# EAGLE design F7 (EAGLE 9.4.0)
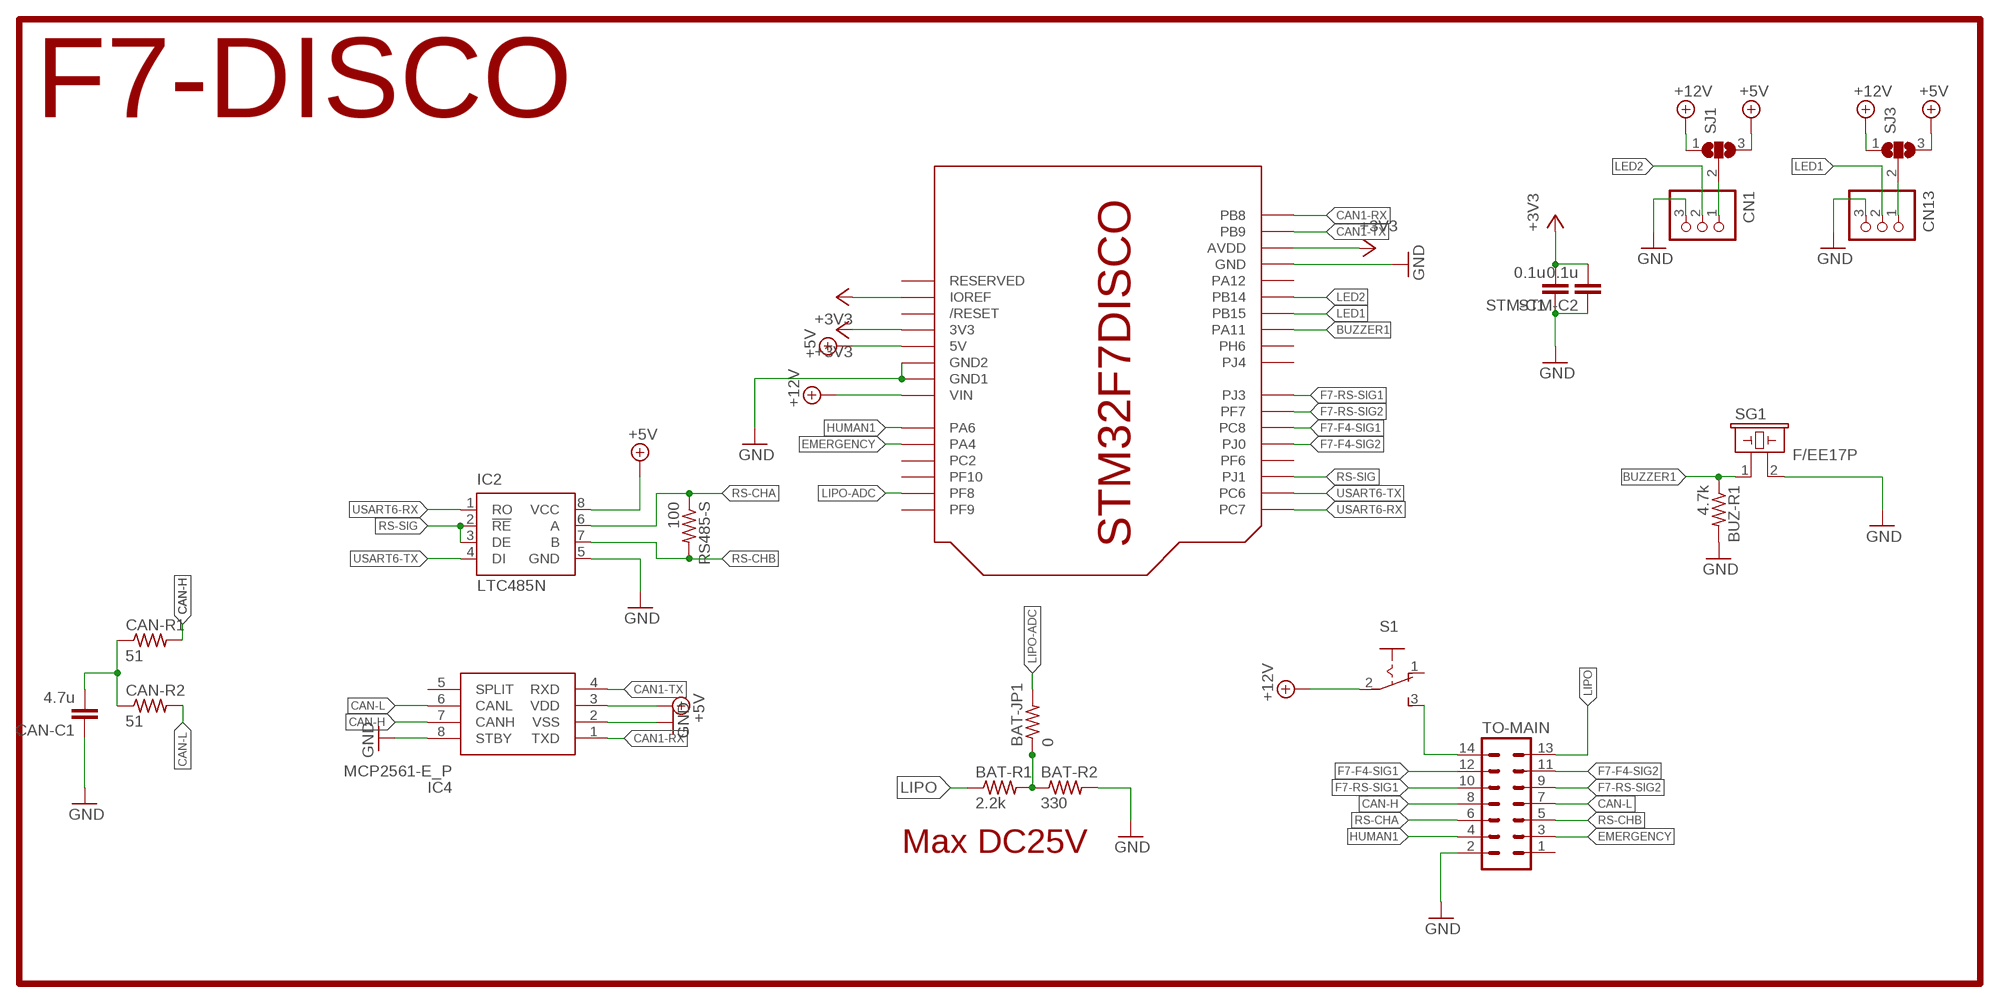
[diagram p0: schematic, sheet 1]

## Parts
BAT-JP1  0  R-US_R0805  [R0805]
BAT-R1  2.2k  R-US_R0805  [R0805]
BAT-R2  330  R-US_R0805  [R0805]
BUZ-R1  4.7k  R-US_R0805  [R0805]
CAN-C1  4.7u  C-EUC0805  [C0805]
CAN-R1  51  R-US_R0805  [R0805]
CAN-R2  51  R-US_R0805  [R0805]
CN1  B3P-VH  [B3P-VH]
CN13  B3P-VH  [B3P-VH]
IC2  LTC485N  [DIL08]
IC4  MCP2561-E_P  [DIP781W56P254L950H533Q8N]
RS485-S  100  R-US_R0805  [R0805]
S1  255SB  [255SB]
SG1  F/EE17P  [F/EE17P]
SJ1  SJ2WW  [SJ_2W]
SJ3  SJ2WW  [SJ_2W]
STM-C1  0.1u  C-EUC0805  [C0805]
STM-C2  0.1u  C-EUC0805  [C0805]
TO-MAIN  ML14  [ML14]
U$1  F7-DISCO-ARDUINO  [F7-DISCO-ARDUINO]

## Nets
+5V: IC2.8(VCC) IC4.3(VDD) SJ1.3 SJ3.3 U$1.5V
+9V: S1.2(P) SJ1.1 SJ3.1 U$1.VIN ; supply symbol labelled +12V
+12V: S1.3(S) TO-MAIN.14
BUZZER1: BUZ-R1.1 SG1.1 U$1.PA11
CAN1-RX: IC4.1(TXD) U$1.PB8
CAN1-TX: IC4.4(RXD) U$1.PB9
CAN-H: CAN-R1.2 IC4.7(CANH) TO-MAIN.8
CAN-L: CAN-R2.2 IC4.6(CANL) TO-MAIN.7
EMERGENCY: TO-MAIN.3 U$1.PA4
F7-F4-SIG1: TO-MAIN.12 U$1.PC8
F7-F4-SIG2: TO-MAIN.11 U$1.PJ0
F7-RS-SIG1: TO-MAIN.10 U$1.PJ3
F7-RS-SIG2: TO-MAIN.9 U$1.PF7
GND: BAT-R2.2 BUZ-R1.2 CAN-C1.1 CN1.3 CN13.3 IC2.5(GND) IC4.2(VSS) IC4.8(STBY) SG1.2 STM-C1.1 STM-C2.1 TO-MAIN.2 U$1.GND1(GND) U$1.GND@1(GND1) U$1.GND@2(GND2)
HUMAN1: TO-MAIN.4 U$1.PA6
LED1: CN13.2 U$1.PB15
LED2: CN1.2 U$1.PB14
LIPO: BAT-R1.1 TO-MAIN.13
LIPO-ADC: BAT-JP1.2 U$1.PF8
N$1: CN1.1 SJ1.2
N$4: CAN-C1.2 CAN-R1.1 CAN-R2.1
N$36: BAT-JP1.1 BAT-R1.2 BAT-R2.1
N$37: CN13.1 SJ3.2
RS-CHA: IC2.6(A) RS485-S.1 TO-MAIN.6
RS-CHB: IC2.7(B) RS485-S.2 TO-MAIN.5
RS-SIG: IC2.2(!RE) IC2.3(DE) U$1.PJ1
USART6-RX: IC2.1(RO) U$1.PC7
USART6-TX: IC2.4(DI) U$1.PC6
VCC: STM-C1.2 STM-C2.2 U$1.3V(3V3) U$1.AVDD U$1.IOREF ; supply symbol labelled +3V3
Unconnected: IC4.5(SPLIT) S1.1(O) TO-MAIN.1 U$1.PA12 U$1.PC2 U$1.PF6 U$1.PF9 U$1.PF10 U$1.PH6 U$1.PJ4 U$1.RESERVED U$1.RESET(/RESET)

## Notes on the sheet
- F7-DISCO
- Max DC25V

## Library data of the parts
BAT-JP1 BAT-R1 BAT-R2 BUZ-R1 CAN-R1 CAN-R2 RS485-S = 0@Mylibrary-main1:R-US_: RESISTOR, American symbol
CAN-C1 STM-C1 STM-C2 = rcl:C-EU: CAPACITOR, European symbol
CN1 CN13 = jst-vh:B3P-VH: Wire-to-Board 3.96mm pitch top mount connector Source: http://www.jst-mfg.com/product/pdf/jpn/VH.pdf http://www.jst-mfg.com/product/detail.php?series=262
IC2 = 0linear-technology:LTC485: Low Power RS485 Interface Transceiver Source: http://www.linear.com/pc/downloadDocument.do?navId=H0,C1,C1007,C1017,P2064,D1718; OC_FARNELL: unknown; OC_NEWARK: unknown
IC4 = MCP2561-E_P:MCP2561-E_P: CAN Transceiver 1Mbps 5V 125degC PDIP8 Microchip MCP2561-E/P, CAN Transceiver 1-channel IEC 61000-4-2, 8-Pin PDIP Source: Datasheet <http://uk.rs-online.com/web/p/products/7990212>; ALLIED_NUMBER: 70415102; ALLIED_PRICE-STOCK: https://www.alliedelec.com/microchip-technology-inc-mcp2561-e-p/70415102/; DESCRIPTION: CAN Transceiver 1Mbps 5V 125degC PDIP8 Microchip MCP2561-E/P, CAN Transceiver 1-channel IEC 61000-4-2, 8-Pin PDIP; HEIGHT: 5.334mm; MANUFACTURER_NAME: Microchip; MANUFACTURER_PART_NUMBER: MCP2561-E/P; MOUSER_PART_NUMBER: 579-MCP2561-E/P; MOUSER_PRICE-STOCK: https://www.mouser.com/Search/Refine.aspx?Keyword=579-MCP2561-E%2FP; RS_PART_NUMBER: 1652124; RS_PRICE-STOCK: http://uk.rs-online.com/web/p/products/1652124
S1 = 0switch:255SB: SLIDING SWITCH Distributor Buerklin, 11G810
SG1 = buzzer:F/EE17P: BUZZER Source: Buerklin; OC_FARNELL: unknown; OC_NEWARK: unknown
SJ1 SJ3 = jumper:SJ2W: SMD solder JUMPER
TO-MAIN = 0con-harting-ml:ML14: HARTING; OC_FARNELL: unknown; OC_NEWARK: unknown
U$1 = F7-DISCO:F7-DISCO-ARDUINO

## Board
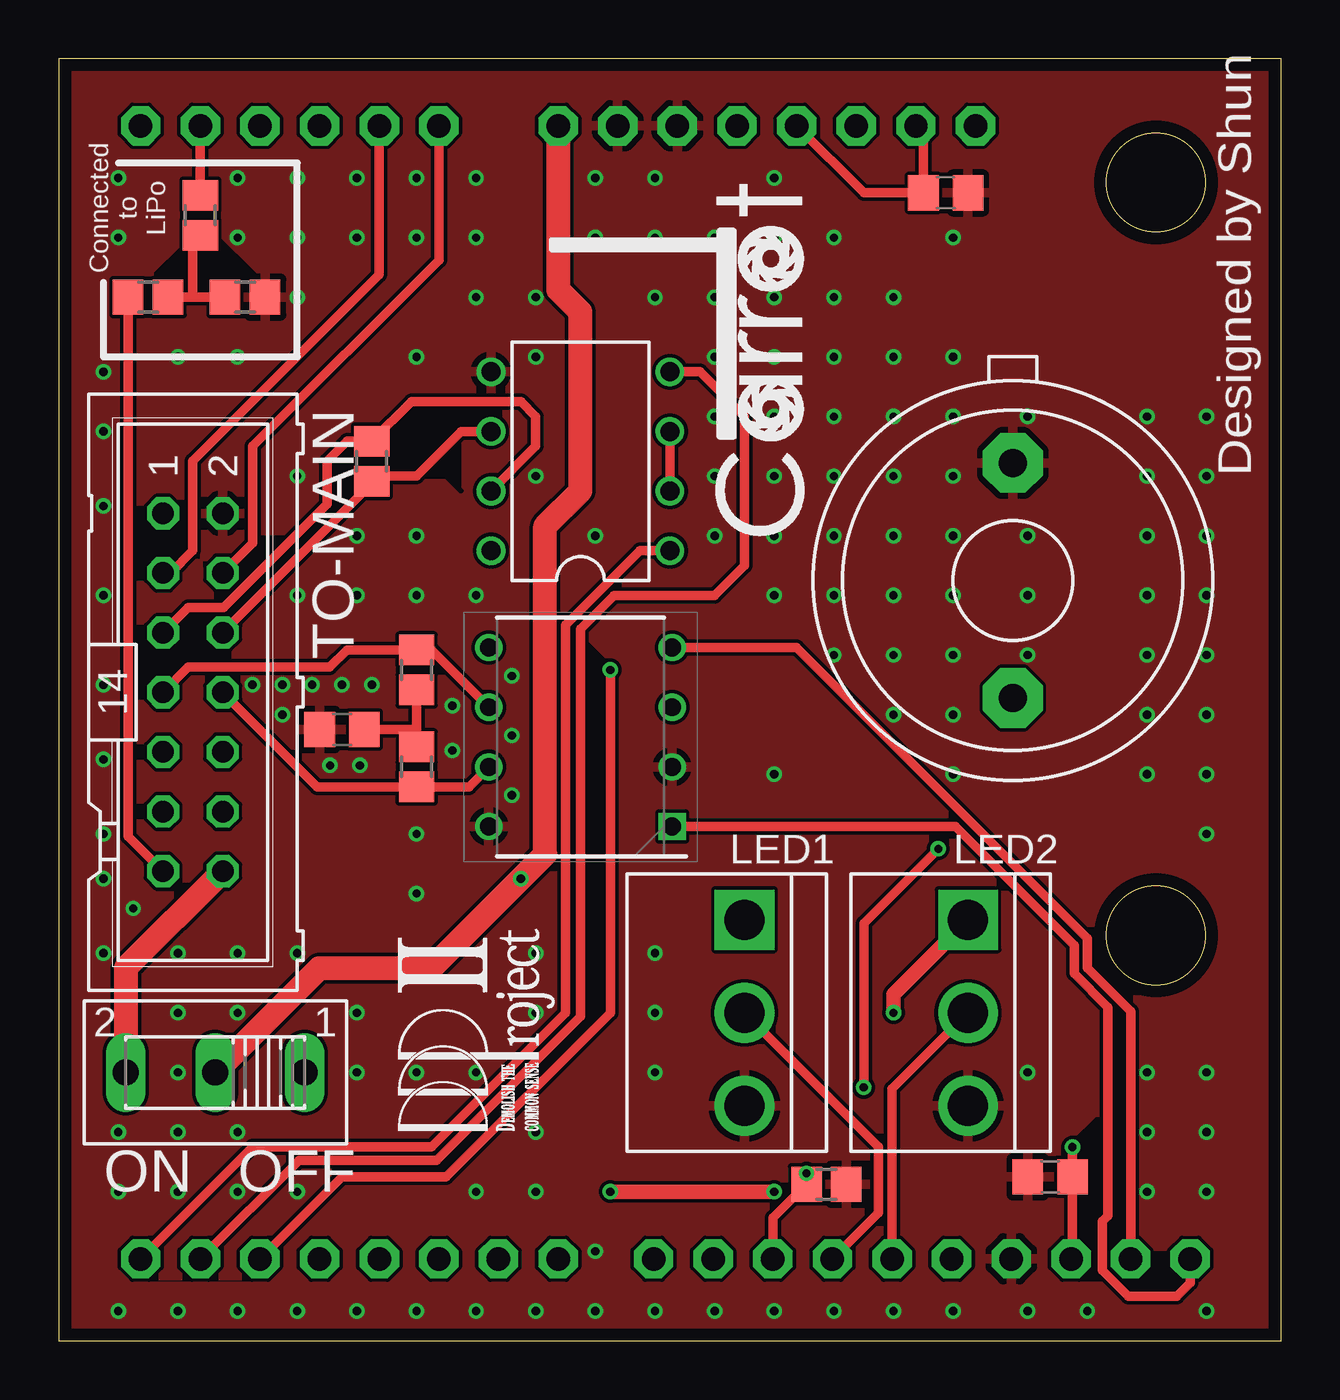
[diagram p1: board, top side]
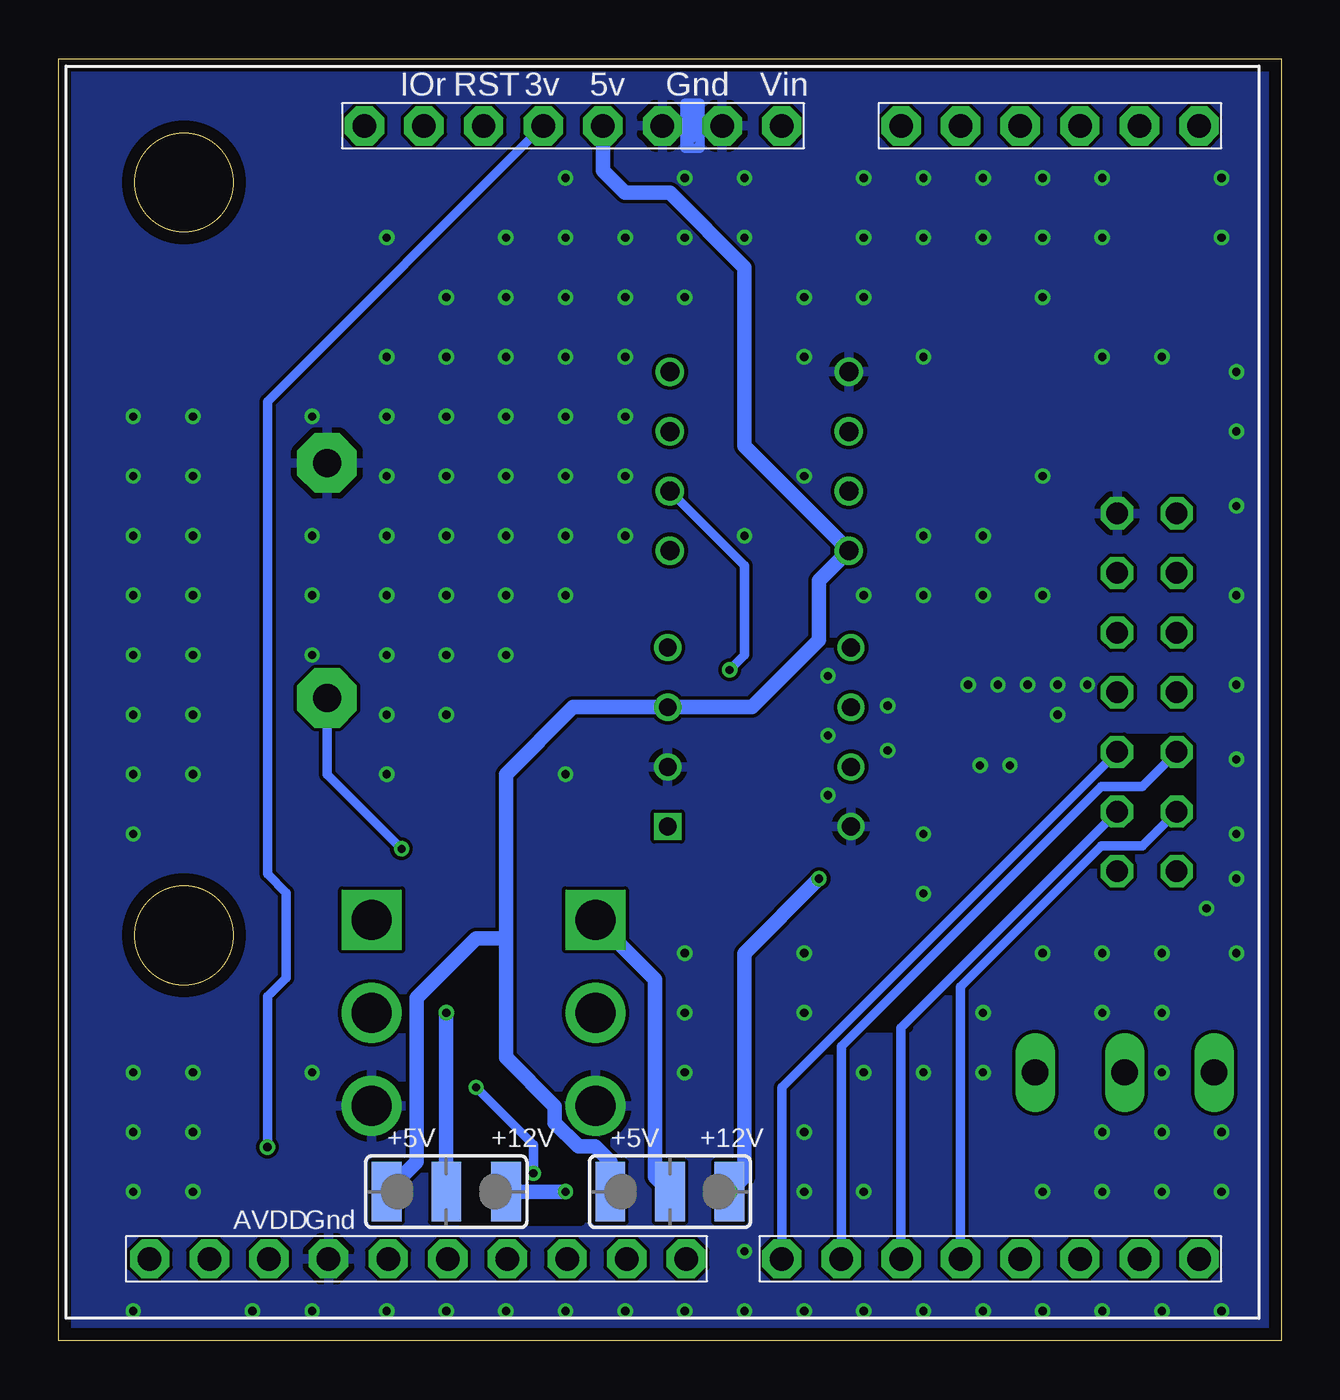
[diagram p2: board, bottom side, seen from below]

Size 52.07 x 54.61 mm. Coordinates in mm from the lower left corner, seen from the top.
Outline: 0,0 52.07,0 52.07,54.61 0,54.61 0,0
Outline: circle at 46.74,49.34 radius 2.1
Outline: circle at 46.74,17.27 radius 2.1
Copper layers (1*16): Top 0.035mm / dielectric 1.6mm / Bottom 0.035mm
Design rules "Elecrow_2-layer_PCB_eagle_rule": minimum track width 6mil, minimum drill 12mil, track to track 6mil, track to pad 6mil, pad to pad 6mil, via to via 8mil, smd to smd 0mil, copper to edge 20mil, drill to drill 10mil, minimum pad ring 6mil, minimum via ring 6mil, stop-mask expansion 0mil, vias tented up to drill 100mil, thermal gap 10mil
tRestrict: 14 lines
bRestrict: 6 lines

### Footprints (pad centres in the part's own frame; a part is rotated, then mirrored left to right if it is on the bottom)
R0805 = smd 1.3 x 1.5: 1 -0.85,0; 2 0.85,0
C0805 = smd 1.3 x 1.5: 1 -0.95,0; 2 0.95,0
B3P-VH = drill 1.7 square: 1 -3.96,0 | drill 1.7: 2 0,0; 3 3.96,0
DIL08 = drill 0.813: 1 -3.81,-3.81; 2 -1.27,-3.81; 3 1.27,-3.81; 4 3.81,-3.81; 5 3.81,3.81; 6 1.27,3.81; 7 -1.27,3.81; 8 -3.81,3.81
DIP781W56P254L950H533Q8N = drill 0.759 pad 1.159 square: 1 -3.905,3.81 | drill 0.759 pad 1.159: 2 -3.905,1.27; 3 -3.905,-1.27; 4 -3.905,-3.81; 5 3.905,-3.81; 6 3.905,-1.27; 7 3.905,1.27; 8 3.905,3.81
255SB = drill 1.118 long: 1 -3.81,0; 2 0,0; 3 3.81,0
F/EE17P = drill 1.194 pad 2.54 octagon: 1 -5.004,0; 2 5.004,0
SJ_2W = smd 1.27 x 2.54: 1 -2.54,0; 2 0,0; 3 2.54,0
ML14 = drill 0.914 octagon: 1 -7.62,-1.27; 2 -7.62,1.27; 3 -5.08,-1.27; 4 -5.08,1.27; 5 -2.54,-1.27; 6 -2.54,1.27; 7 0,-1.27; 8 0,1.27; 9 2.54,-1.27; 10 2.54,1.27; 11 5.08,-1.27; 12 5.08,1.27; 13 7.62,-1.27; 14 7.62,1.27
F7-DISCO-ARDUINO = drill 1 pad 1.676 octagon: 3V 20.32,50.8; 5V 22.86,50.8; AVDD 8.636,2.54; GND1 11.176,2.54; GND@1 27.94,50.8; GND@2 25.4,50.8; IOREF 15.24,50.8; PA4 38.1,50.8; PA6 35.56,50.8; PA11 21.336,2.54; PA12 13.716,2.54; PB8 3.556,2.54; PB9 6.096,2.54; PB14 16.256,2.54; PB15 18.796,2.54; PC2 40.64,50.8; PC6 45.72,2.54; PC7 48.26,2.54; PC8 35.56,2.54; PF6 40.64,2.54; PF7 33.02,2.54; PF8 45.72,50.8; PF9 48.26,50.8; PF10 43.18,50.8; PH6 23.876,2.54; PJ0 38.1,2.54; PJ1 43.18,2.54; PJ3 30.48,2.54; PJ4 26.416,2.54; RESERVED 12.7,50.8; RESET 17.78,50.8; VIN 30.48,50.8

### Placement (x,y rotation side)
BAT-JP1  6.03,47.94 90 top
BAT-R1  3.81,44.45 0 top
BAT-R2  7.94,44.45 0 top
BUZ-R1  32.7,6.67 0 top
CAN-C1  12.06,26.04 0 top
CAN-R1  15.24,24.45 270 top
CAN-R2  15.24,28.57 90 top
CN1  38.73,13.97 270 top
CN13  29.21,13.97 270 top
IC2  22.23,37.47 90 top
IC4  22.23,25.72 180 top
RS485-S  13.34,37.47 90 top
S1  6.67,11.43 180 top
SG1  40.64,32.38 90 top
SJ1  35.56,6.35 180 bottom
SJ3  26.04,6.35 180 bottom
STM-C1  37.78,48.9 180 top
STM-C2  42.23,6.99 0 top
TO-MAIN  5.71,27.62 270 top
U$1  51.75,0.95 0 bottom
U$4  [CARROT-SILK]  31.75,34.29 90 top
U$9  [DDPROJECT2]  22.86,8.26 90 top

### Tracks (layer width: path | path; a pad name or v marks a point on that pad's centre or on a via)
+5V
  Bottom 0.61: U$1.5V 28.89,49.85 27.94,48.9 26.04,48.9 22.86,45.72 22.86,38.1 IC2.8 19.68,32.38 19.68,29.84 22.54,26.99 IC4.3 30.16,26.99 33.02,24.13 33.02,17.14 | 33.02,17.14 33.02,12.06 30.94,9.99 30.94,9.29 29.93,8.28 29.23,8.28 28.57,7.62 SJ3.3 | 33.02,17.14 34.29,17.14 36.83,14.61 36.83,7.62 SJ1.3
+9V  (via drill 0.35)
  Top 0.61: v30.48,6.35 SJ3.1
  Top 1.016: S1.2 11.11,15.88 15.88,15.88 v19.68,19.68 20.73,20.73 20.73,34.7 22.23,36.2 22.23,43.81 21.27,44.77 U$1.VIN
  Bottom 0.61: SJ1.1 v30.48,6.35 | SJ3.1 22.86,6.99 22.86,16.51 v19.68,19.68
  other vias: 23.5,6.35
+12V
  Top 1.016: TO-MAIN.14 2.86,15.88 S1.3
BUZZER1  (via drill 0.35)
  Top 0.406: U$1.PA11 30.42,5.23 BUZ-R1.1 | v34.29,10.79 34.29,17.78 v37.47,20.95
  Top 0.61: BUZ-R1.1 v31.85,7.13
  Bottom 0.406: v31.85,7.13 31.85,8.36 v34.29,10.79 | v37.47,20.95 40.64,24.13 SG1.1
CAN1-RX
  Top 0.406: U$1.PB8 48.2,2.48 47.62,1.91 45.56,1.91 44.45,3.01 44.45,5.08 44.69,5.32 44.69,14.21 43.26,15.64 43.26,16.84 38.19,21.91 IC4.1
CAN1-TX
  Top 0.406: U$1.PB9 45.66,14.03 43.81,15.88 43.81,17.14 31.43,29.53 IC4.4
CAN-H
  Top 0.406: TO-MAIN.8 11.01,23.6 CAN-R1.2 17.47,23.6 IC4.7
CAN-L
  Top 0.406: TO-MAIN.7 5.51,28.69 11.54,28.69 12.28,29.43 CAN-R2.2 15.88,29.43 IC4.6
EMERGENCY
  Top 0.406: U$1.PA4 13.65,45.4 5.71,37.47 5.71,33.66 4.76,32.7 TO-MAIN.3
F7-F4-SIG1
  Bottom 0.406: TO-MAIN.12 16.19,13.34 U$1.PC8
F7-F4-SIG2
  Bottom 0.406: TO-MAIN.11 5.92,21.07 7.67,21.07 13.65,15.09 U$1.PJ0
F7-RS-SIG1
  Bottom 0.406: TO-MAIN.10 21.27,10.79 U$1.PJ3
F7-RS-SIG2
  Bottom 0.406: TO-MAIN.9 5.92,23.61 7.67,23.61 18.73,12.54 U$1.PF7
GND  (via drill 0.35)
  Bottom 0.406: 25.4,52.7 25.4,50.8 24.77,50.8 24.77,52.7 25.4,52.7 | 25.15,51.18 25.15,52.32 25.02,52.32 25.4,52.7
  other vias: 25.4,16.51 25.4,13.97 20.32,6.35 20.32,8.89 25.4,11.43 41.27,29.21 46.35,29.21 46.35,26.67 46.35,24.13 33.02,29.21 35.56,29.21 35.56,26.67 30.48,24.13 12.7,13.97 2.54,6.35 2.54,8.89 5.08,8.89 7.62,8.89 7.62,6.35 5.08,6.35 30.48,46.99 30.48,49.53 33.02,46.99 30.48,44.45 33.02,44.45 35.56,44.45 22.86,49.53 25.4,49.53 25.4,46.99 22.86,46.99 20.32,44.45 25.4,44.45 10.16,46.99 10.16,49.53 12.7,49.53 15.24,49.53 15.24,46.99 12.7,46.99 10.16,44.45 2.54,49.53 2.54,46.99 5.08,41.91 10.16,36.83 12.7,34.29 15.24,34.29 10.16,31.75 12.7,31.75 15.24,31.75 30.48,36.83 30.48,39.37 33.02,39.37 35.56,39.37 35.56,36.83 33.02,36.83 30.48,34.29 33.02,34.29 35.56,34.29 38.1,36.83 38.1,39.37 38.1,34.29 41.27,39.37 46.35,39.37 46.35,36.83 41.27,34.29 46.35,34.29 48.9,26.67 48.9,29.21 48.9,24.13 38.1,26.67 38.1,29.21 38.1,24.13 41.27,11.43 46.35,11.43 41.27,1.27 43.81,1.27 33.02,1.27 38.1,1.27 35.56,1.27 25.4,1.27 30.48,1.27 27.94,1.27 22.86,3.81 17.78,6.35 12.7,1.27 15.24,1.27 17.78,1.27 2.54,1.27 5.08,1.27 7.62,1.27 10.16,6.35 10.16,1.27 20.32,1.27 15.24,19.05 20.32,16.51 20.32,13.97 15.24,11.43 17.78,11.43 12.7,11.43 5.08,11.43 5.08,16.51 10.16,16.51 7.62,16.51 5.08,13.97 7.62,13.97 15.24,21.59 20.32,36.83 22.86,34.29 15.24,41.91 17.78,46.99 17.78,49.53 17.78,44.45 7.62,46.99 7.62,49.53 7.62,41.91 27.94,46.99 27.94,44.45 30.48,41.91 33.02,41.91 35.56,41.91 27.94,36.83 27.94,39.37 27.94,34.29 20.32,41.91 17.78,31.75 46.35,8.89 46.35,6.35 48.9,6.35 48.9,8.89 30.48,31.75 33.02,31.75 35.56,31.75 41.27,31.75 46.35,31.75 38.1,31.75 48.9,36.83 48.9,39.37 48.9,34.29 48.9,31.75 38.1,46.99 38.1,41.91 27.94,41.91 48.9,21.59 48.9,11.43 48.9,1.27 13.34,27.94 10.79,27.94 8.26,27.94 9.53,26.67 12.83,24.51 11.56,24.51 12.06,27.94 9.53,27.94 16.76,27.05 16.76,25.15 19.3,25.78 19.3,23.24 19.3,28.32 1.91,27.94 1.91,31.75 1.91,35.56 1.91,38.73 1.91,41.27 1.91,24.77 1.91,21.59 1.91,19.68 1.91,16.51 3.17,18.41 22.86,1.27
  pour Top: 0,54.61 52.07,54.61 52.07,0 0,0
  pour Bottom: 0,54.61 51.44,54.61 51.44,0 0,0
HUMAN1
  Top 0.406: TO-MAIN.4 8.26,33.97 8.26,38.1 16.19,46.04 U$1.PA6
LED1
  Top 0.406: U$1.PB15 34.92,5.46 34.92,8.26 CN13.2
LED2
  Top 0.406: CN1.2 35.5,10.73 U$1.PB14
LIPO
  Top 0.406: TO-MAIN.13 2.96,21.49 BAT-R1.1
LIPO-ADC
  Top 0.406: U$1.PF8 BAT-JP1.2
N$1  (via drill 0.35)
  Top 0.61: v35.56,13.97 35.56,14.76 CN1.1
  Bottom 0.61: SJ1.2 v35.56,13.97
N$4
  Top 0.406: CAN-R1.1 15.24,26.04 | 15.24,26.04 CAN-R2.1 | 15.24,26.04 CAN-C1.2
N$36
  Top 0.406: BAT-R1.2 5.71,44.45 | BAT-R2.1 5.71,44.45 | 5.71,44.45 5.71,46.77 BAT-JP1.1
N$37
  Bottom 0.61: CN13.1 26.67,15.39 26.67,6.99 SJ3.2
RS-CHA
  Top 0.406: TO-MAIN.6 13.34,36.51 RS485-S.1 13.55,36.83 15.24,36.83 17.14,38.73 IC2.6
RS-CHB
  Top 0.406: TO-MAIN.5 5.51,31.23 7.02,31.23 11.43,35.64 11.43,37.47 12.28,38.31 RS485-S.2 15.03,40.01 19.68,40.01 20.32,39.37 20.32,38.1 IC2.7
RS-SIG  (via drill 0.35)
  Top 0.406: U$1.PJ1 12.06,6.99 16.51,6.99 23.5,13.97 v23.5,28.57 | IC2.2 IC2.3
  Bottom 0.406: IC2.2 22.86,33.02 22.86,29.21 v23.5,28.57
USART6-RX
  Top 0.406: U$1.PC7 8.26,8.26 15.88,8.26 21.59,13.97 21.59,30.48 24.77,33.66 IC2.1
USART6-TX
  Top 0.406: U$1.PC6 10.24,7.7 16.11,7.7 22.23,13.81 22.23,30.32 23.65,31.75 27.94,31.75 29.21,33.02 29.21,39.37 27.3,41.27 IC2.4
VCC  (via drill 0.35)
  Top 0.406: U$1.IOREF 36.83,51.43 STM-C1.2 34.29,48.9 U$1.3V | U$1.AVDD 43.18,3.55 STM-C2.2 v43.18,8.26
  Bottom 0.406: U$1.3V 43.18,40.01 43.18,19.88 42.38,19.08 42.38,15.47 43.18,14.67 v43.18,8.26

### Text on the board
tPlace: Connected / to / LiPo | Designed by Shun | LED1 | LED2 | ON | OFF
bPlace: +12V | +5V | +12V | +5V